# EAGLE design IoT Remote Control (EAGLE 9.6.2)
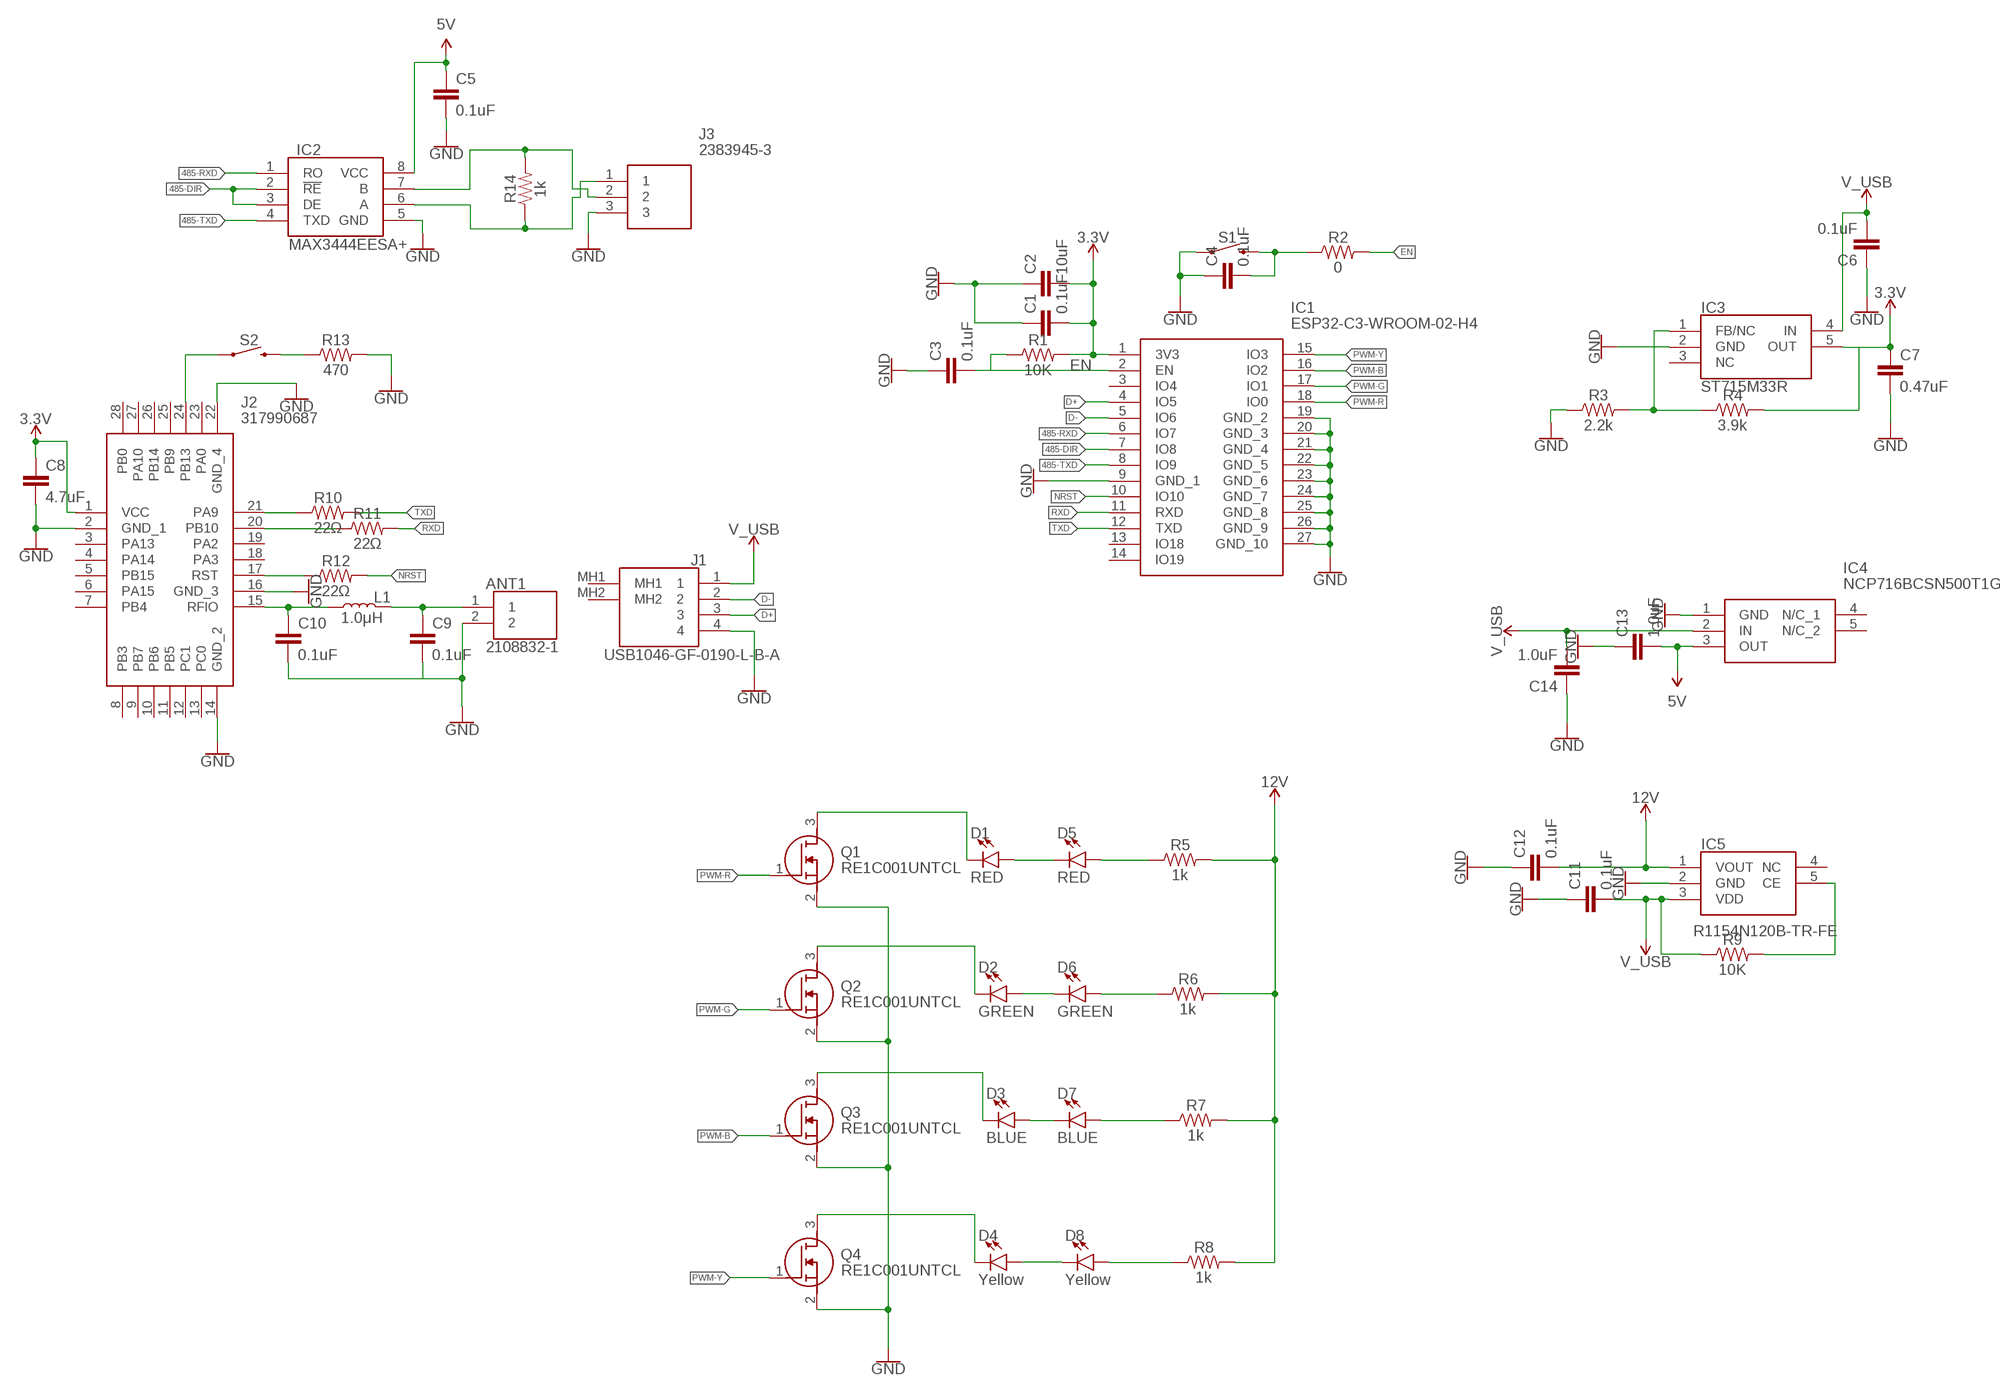
[diagram p0: schematic, sheet 1]

## Parts
ANT1  2108832-1  [21088321]
C1  0.1uF  0.1UF-0402T-6.3V-10%-X7R  [0402-TIGHT]
C2  10uF  10UF-0402T-6.3V-20%  [0402-TIGHT]
C3  0.1uF  0.1UF-0402T-6.3V-10%-X7R  [0402-TIGHT]
C4  0.1uF  0.1UF-0402T-6.3V-10%-X7R  [0402-TIGHT]
C5  0.1uF  0.1UF-0402T-6.3V-10%-X7R  [0402-TIGHT]
C6  0.1uF  0.1UF-0402T-6.3V-10%-X7R  [0402-TIGHT]
C7  0.47uF  470NF-0402_TIGHT-6.3V-10%-X5R  [0402-TIGHT]
C8  4.7uF  4.7UF-0402_TIGHT-6.3V-20%-X5R  [0402-TIGHT]
C9  0.1uF  0.1UF-0402T-6.3V-10%-X7R  [0402-TIGHT]
C10  0.1uF  0.1UF-0402T-6.3V-10%-X7R  [0402-TIGHT]
C11  0.1uF  0.1UF-0402T-6.3V-10%-X7R  [0402-TIGHT]
C12  0.1uF  0.1UF-0402T-6.3V-10%-X7R  [0402-TIGHT]
C13  1.0uF  1.0UF-0402T-16V-10%  [0402-TIGHT]
C14  1.0uF  1.0UF-0402T-16V-10%  [0402-TIGHT]
D1  RED  LED-RED0603  [LED-0603]
D2  GREEN  LED-GREEN0603  [LED-0603]
D3  BLUE  LED-BLUE0603  [LED-0603]
D4  Yellow  LED-YELLOW0603  [LED-0603]
D5  RED  LED-RED0603  [LED-0603]
D6  GREEN  LED-GREEN0603  [LED-0603]
D7  BLUE  LED-BLUE0603  [LED-0603]
D8  Yellow  LED-YELLOW0603  [LED-0603]
IC1  ESP32-C3-WROOM-02-H4  [ESP32C3WROOM02H4]
IC2  MAX3444EESA+  [SOIC127P600X175-8N]
IC3  ST715M33R  [SOT95P280X145-5N]
IC4  NCP716BCSN500T1G  [SOT95P275X110-5N]
IC5  R1154N120B-TR-FE  [SOT95P280X130-5N]
J1  USB1046-GF-0190-L-B-A  [USB1046GF0190LBA]
J2  317990687  [317990687]
J3  2383945-3  [23839453]
L1  1.0μH  1.0μH-0805_WIDE-1.0μH-1.4A-0.07OHM-1.4MM_H  [0805-WIDE]
Q1  RE1C001UNTCL  [SOTFL50P160X85-3N]
Q2  RE1C001UNTCL  [SOTFL50P160X85-3N]
Q3  RE1C001UNTCL  [SOTFL50P160X85-3N]
Q4  RE1C001UNTCL  [SOTFL50P160X85-3N]
R1  10K  10KOHM-0402-1/10W-0.1%  [0402-TIGHT]
R2  0  0OHM-0402T-1/10W  [0402-TIGHT]
R3  2.2k  2.2KOHM-0402T-1/16W-1%  [0402-TIGHT]
R4  3.9k  3.9KOHM-0603-1/10W-1%  [0603]
R5  1k  1KOHM-0402T-1/16W-1%  [0402-TIGHT]
R6  1k  1KOHM-0402T-1/16W-1%  [0402-TIGHT]
R7  1k  1KOHM-0402T-1/16W-1%  [0402-TIGHT]
R8  1k  1KOHM-0402T-1/16W-1%  [0402-TIGHT]
R9  10K  10KOHM-0402-1/10W-0.1%  [0402-TIGHT]
R10  22Ω  22OHM-0402T-1/16W-1%  [0402-TIGHT]
R11  22Ω  22OHM-0402T-1/16W-1%  [0402-TIGHT]
R12  22Ω  22OHM-0402T-1/16W-1%  [0402-TIGHT]
R13  470  470OHM-0402-TIGHT-1/16W-1%  [0402-TIGHT]
R14  1k  1KOHM-0402T-1/16W-1%  [0402-TIGHT]
S1  MOMENTARY-SWITCH-SPST-SMD-4.6X2.8MM  [TACTILE_SWITCH_SMD_4.6X2.8MM]
S2  MOMENTARY-SWITCH-SPST-SMD-4.6X2.8MM  [TACTILE_SWITCH_SMD_4.6X2.8MM]

## Nets
3.3V: C1.2 C2.2 C7.1 C8.1 IC1.1(3V3) IC3.5(OUT) J2.1(VCC) R1.2 R4.2
5V: C5.1 C13.2 IC2.8(VCC) IC4.3(OUT)
12V: C12.2 IC5.1(VOUT) R5.2 R6.2 R7.2 R8.2
485-DIR: IC1.7(IO8) IC2.2(!RE) IC2.3(DE)
485-RXD: IC1.6(IO7) IC2.1(RO)
485-TXD: IC1.8(IO9) IC2.4(TXD)
D+: IC1.4(IO5) J1.3
D-: IC1.5(IO6) J1.2
EN: C3.2 IC1.2(EN) R2.2
GND: ANT1.2 C1.1 C2.1 C3.1 C4.1 C5.2 C6.1 C7.2 C8.2 C10.2 C11.1 C12.1 C13.1 C14.1 IC1.9(GND_1) IC1.19(GND_2) IC1.20(GND_3) IC1.21(GND_4) IC1.22(GND_5) IC1.23(GND_6) IC1.24(GND_7) IC1.25(GND_8) IC1.26(GND_9) IC1.27(GND_10) IC2.5(GND) IC3.2(GND) IC4.1(GND) IC5.2(GND) J1.4 J2.2(GND_1) J2.14(GND_2) J2.16(GND_3) J2.22(GND_4) J3.3 Q1.2(S) Q2.2(S) Q3.2(S) Q4.2(S) R3.1 R13.2 S1.1 S1.2
N$1: C4.2 R2.1 S1.3 S1.4
N$2: IC3.1(FB/NC) R3.2 R4.1
N$3: R1.1
N$4: D3.A D7.C
N$5: D1.C Q1.3(D)
N$6: D2.C Q2.3(D)
N$7: D7.A R7.1
N$8: D8.A R8.1
N$9: D3.C Q3.3(D)
N$10: D4.C Q4.3(D)
N$11: D4.A D8.C
N$12: D6.A R6.1
N$13: IC5.5(CE) R9.2
N$14: D2.A D6.C
N$15: D1.A D5.C
N$16: D5.A R5.1
N$18: J2.21(PA9) R10.1
N$19: J2.20(PB10) R11.1
N$20: C10.1 J2.15(RFIO) L1.1
N$21: ANT1.1 C9.1 L1.2
N$22: C9.2
N$23: J2.17(RST) R12.1
N$24: J2.24(PB13) S2.1 S2.2
N$25: R13.1 S2.3 S2.4
N$26: IC2.7(B) J3.2 R14.2
N$27: IC2.6(A) J3.1 R14.1
NRST: IC1.10(IO10) R12.2
PWM-B: IC1.16(IO2) Q3.1(G)
PWM-G: IC1.17(IO1) Q2.1(G)
PWM-R: IC1.18(IO0) Q1.1(G)
PWM-Y: IC1.15(IO3) Q4.1(G)
RXD: IC1.11(RXD) R11.2
TXD: IC1.12(TXD) R10.2
V_USB: C6.2 C11.2 C14.2 IC3.4(IN) IC4.2(IN) IC5.3(VDD) J1.1 R9.1
Unconnected: IC1.3(IO4) IC1.13(IO18) IC1.14(IO19) IC3.3(NC) IC4.4(N/C_1) IC4.5(N/C_2) IC5.4(NC) J1.MH1 J1.MH2 J2.3(PA13) J2.4(PA14) J2.5(PB15) J2.6(PA15) J2.7(PB4) J2.8(PB3) J2.9(PB7) J2.10(PB6) J2.11(PB5) J2.12(PC1) J2.13(PC0) J2.18(PA3) J2.19(PA2) J2.23(PA0) J2.25(PB9) J2.26(PB14) J2.27(PA10) J2.28(PB0)

## Library data of the parts
ANT1 = 2108832-1:2108832-1: Antennas Chip ant., SMD, BT/Wi-Fi 2.4GHz Source: Datasheet <https://www.te.com/commerce/DocumentDelivery/DDEController?Action=showdoc&DocId=Customer Drawing2108832-CApdfEnglishENG_CD_2108832-C_A.pdf2108832-1>; DESCRIPTION: Antennas Chip ant., SMD, BT/Wi-Fi 2.4GHz; HEIGHT: 1.35mm; MANUFACTURER_NAME: TE Connectivity; MANUFACTURER_PART_NUMBER: 2108832-1
C1 C3-C6 C9-C12 = SparkFun-Capacitors:0.1UF: 0.1µF ceramic capacitors A capacitor is a passive two-terminal electrical component used to store electrical energy temporarily in an electric field.; PROD_ID: CAP-14993
C2 = SparkFun-Capacitors:10UF: 10.0µF ceramic capacitors A capacitor is a passive two-terminal electrical component used to store electrical energy temporarily in an electric field.; PROD_ID: CAP-14848
C7 = SparkFun-Capacitors:470NF: 0.47uF/470nF ceramic capacitors A capacitor is a passive two-terminal electrical component used to store electrical energy temporarily in an electric field.; PROD_ID: CAP-14242
C8 = SparkFun-Capacitors:4.7UF: 4.7µF ceramic capacitors A capacitor is a passive two-terminal electrical component used to store electrical energy temporarily in an electric field.; PROD_ID: CAP-14240
C13 C14 = SparkFun-Capacitors:1.0UF: 1µF ceramic capacitors A capacitor is a passive two-terminal electrical component used to store electrical energy temporarily in an electric field.; PROD_ID: CAP-12417
D1 D5 = SparkFun-LED:LED-RED: Red SMD LED Used in manufacturing of most products at SparkFun Packages: 0603 - SMD 0603 package [Product Link] <http://docs.avagotech.com/docs/AV02-0551EN> 0603 SMART - SMD 0603 SMART package ( more efficient and expensive)[Product Link] <http://www.osram-os.com/Graphics/XPic2/00077099_0.pdf> 1206 - SMD1206 package [Product Link] <https://www.sparkfun.com/datasheets/DevTools/LilyPad/Q150OVS4.pdff> SparkFun Products: Pro Mini 328 -5V <https://www.sparkfun.com/products/821> RedBoard <https://www.sparkfun.com/products/12757> IOIO-OTG <https://www.sparkfun.com/products/13613>; PROD_ID: DIO-00819
D2 D6 = SparkFun-LED:LED-GREEN: Green SMD LED Used in manufacturing of various products at SparkFun Packages: 0603 - SMD 0603 package [Product Link] <http://www.futureelectronics.com/en/technologies/semiconductors/optoelectronics/leds/Pages/9894312-LTST-C190GKT.aspx?CrossPart=HSMG-C190&IM=0> LilyPad 1206 - SMD1206 LilyPad package [Product Link] <http://www.futureelectronics.com/en/Technologies/Product.aspx?ProductID=IN150NGHARVATEKCORPORATION2049943&IM=0> 1206 - SMD1206 package [Product Link] <http://www.futureelectronics.com/en/technologies/semiconductors/optoelectronics/leds/Pages/8315665-LTST-C150KGKT.aspx?IM=0> 1206 Bottom Mount -SMD 1206 Bottom Mount [Product Link] <http://www.digikey.com/product-detail/en/lite-on-inc/LTST-C230KGKT/160-1456-1-ND/386854> SparkFun Products: Pro Mini 328 -5V <https://www.sparkfun.com/products/821> RedBoard <https://www.sparkfun.com/products/12757> MP3 Trigger <https://www.sparkfun.com/products/13720> Makey Makey <https://www.sparkfun.com/products/11076>; PROD_ID: DIO-00821
D3 D7 = SparkFun-LED:LED-BLUE: Blue SMD LED Used in manufacturing of various products at SparkFun Packages: 0603 - SMD 0603 package [Product Link] <http://www.digikey.com/product-detail/en/SMLE12BC7TT86/511-1589-2-ND/1641808> 1206 - SMD1206 package [Product Link] <http://www.digikey.com/product-detail/en/lite-on-inc/LTST-C150TBKT/160-1643-1-ND/573584> SparkFun Products: ESP8266 Thing-Dev Board <https://www.sparkfun.com/products/13711> RedBoard <https://www.sparkfun.com/products/12757>; PROD_ID: DIO-08575
D4 D8 = SparkFun-LED:LED-YELLOW: Yellow SMD LED Used in manufacturing several products at SparkFun. Packages: 0603 - SMD 0603 package[Product Link] <http://www.kingbrightusa.com/product.asp?catalog_name=LED&product_id=APT1608SYCK> 0603 -SMART - SMART SMD 0603 package (more efficient/more expensive) [Product Link] <http://www.osram-os.com/osram_os/en/products/product-catalog/led-light-emitting-diodes/smartled-0603/ly-l29k/index.jsp> LilyPad - SMD1206 package[Product Datasheet] <https://www.sparkfun.com/datasheets/DevTools/LilyPad/Q150YUS4.pdf> SparkFun Products: Blynk Board <https://www.sparkfun.com/products/13794> IOIO-OTG <https://www.sparkfun.com/products/13613> XBee Explorer Serial <https://www.sparkfun.com/products/13225>; PROD_ID: DIO-09003
IC1 = ESP32-C3-WROOM-02-H4:ESP32-C3-WROOM-02-H4: WiFi Modules (802.11) SMD module, ESP32-C3, 4MB SPI flash, PCB antenna, -40 C +105 C Source: Datasheet <https://www.mouser.in/datasheet/2/891/Espressif_Systems_04082021_ESP32_C3_WROOM_02-2295851.pdf>; DESCRIPTION: WiFi Modules (802.11) SMD module, ESP32-C3, 4MB SPI flash, PCB antenna, -40 C +105 C; HEIGHT: 3.35mm; MANUFACTURER_NAME: Espressif Systems; MANUFACTURER_PART_NUMBER: ESP32-C3-WROOM-02-H4; MOUSER_PART_NUMBER: 356-ESP32C3WROOM02H4; MOUSER_PRICE-STOCK: https://www.mouser.co.uk/ProductDetail/Espressif-Systems/ESP32-C3-WROOM-02-H4?qs=stqOd1AaK79%2FSA14oWtR%252Bw%3D%3D
IC2 = MAX3444EESA+:MAX3444EESA+: Maxim MAX3444EESA+, Line Transceiver, RS-485, 4.75 5.25 V, 8-Pin SOIC Source: Datasheet <https://pdfserv.maximintegrated.com/en/ds/MAX3440E-MAX3444E.pdf>; DESCRIPTION: Maxim MAX3444EESA+, Line Transceiver, RS-485, 4.75 5.25 V, 8-Pin SOIC; HEIGHT: 1.75mm; MANUFACTURER_NAME: Maxim Integrated; MANUFACTURER_PART_NUMBER: MAX3444EESA+; MOUSER_PART_NUMBER: 700-MAX3444EESA; MOUSER_PRICE-STOCK: https://www.mouser.co.uk/ProductDetail/Maxim-Integrated/MAX3444EESA%2b/?qs=1THa7WoU59Hlh25KMQ%252Bj%252BQ%3D%3D
IC3 = ST715M33R:ST715M33R: LDO Voltage Regulators HI INPUT VOLTAGE 85mA LDO LINEAR REG Source: Datasheet <https://datasheet.datasheetarchive.com/originals/distributors/Datasheets-DGA25/1774080.pdf>; ARROW_PART_NUMBER: ST715M33R; ARROW_PRICE-STOCK: https://www.arrow.com/en/products/st715m33r/stmicroelectronics?region=nac; DESCRIPTION: LDO Voltage Regulators HI INPUT VOLTAGE 85mA LDO LINEAR REG; HEIGHT: 1.45mm; MANUFACTURER_NAME: STMicroelectronics; MANUFACTURER_PART_NUMBER: ST715M33R; MOUSER_PART_NUMBER: 511-ST715M33R; MOUSER_PRICE-STOCK: https://www.mouser.co.uk/ProductDetail/STMicroelectronics/ST715M33R?qs=SU4Xa%252BYHGQp%252B3Qoof482xw%3D%3D
IC4 = NCP716BCSN500T1G:NCP716BCSN500T1G: LDO Voltage Regulators WIDE VIN LDO LINEAR VOLTAGE REGULATOR 5V VERSION Source: Datasheet <https://www.mouser.jp/datasheet/2/308/NCP716BC_D-2255835.pdf>; DESCRIPTION: LDO Voltage Regulators WIDE VIN LDO LINEAR VOLTAGE REGULATOR 5V VERSION; HEIGHT: 1.1mm; MANUFACTURER_NAME: onsemi; MANUFACTURER_PART_NUMBER: NCP716BCSN500T1G; MOUSER_PART_NUMBER: 863-NCP716BCSN500T1G; MOUSER_PRICE-STOCK: https://www.mouser.co.uk/ProductDetail/onsemi/NCP716BCSN500T1G?qs=stqOd1AaK79aqdrzlQcxdg%3D%3D
IC5 = R1154N120B-TR-FE:R1154N120B-TR-FE: 150 mA Voltage Regulator (Wide Input Voltage Range) Source: Datasheet <https://www.nisshinbo-microdevices.co.jp/en/pdf/datasheet/r1154-ea.pdf>; DESCRIPTION: 150 mA Voltage Regulator (Wide Input Voltage Range); HEIGHT: 1.3mm; MANUFACTURER_NAME: Nisshinbo; MANUFACTURER_PART_NUMBER: R1154N120B-TR-FE
J1 = USB1046-GF-0190-L-B-A:USB1046-GF-0190-L-B-A: USB Connectors USB A Skt, Top Mount, SMT, R/A, GF, Black, With 1.9mm shell stake, T&R Source: Datasheet <https://gct.co/files/drawings/usb1046.pdf?v=ccb5d20d-0631-4297-aa3c-9c34fccf9fbc>; DESCRIPTION: USB Connectors USB A Skt, Top Mount, SMT, R/A, GF, Black, With 1.9mm shell stake, T&R; HEIGHT: 7.2mm; MANUFACTURER_NAME: GCT (GLOBAL CONNECTOR TECHNOLOGY); MANUFACTURER_PART_NUMBER: USB1046-GF-0190-L-B-A; MOUSER_PART_NUMBER: 640-USB1046GF0190LBA; MOUSER_PRICE-STOCK: https://www.mouser.co.uk/ProductDetail/GCT/USB1046-GF-0190-L-B-A?qs=KUoIvG%2F9IlbZOJtEsn1unA%3D%3D
J2 = 317990687:317990687: Sub-GHz Modules LoRa-E5 Wireless Module Source: Datasheet <https://files.seeedstudio.com/products/317990687/res/LoRa-E5 module datasheet_V1.0.pdf>; DESCRIPTION: Sub-GHz Modules LoRa-E5 Wireless Module; HEIGHT: 2.5mm; MANUFACTURER_NAME: Seeed Studio; MANUFACTURER_PART_NUMBER: 317990687; MOUSER_PART_NUMBER: 713-317990687; MOUSER_PRICE-STOCK: https://www.mouser.co.uk/ProductDetail/Seeed-Studio/317990687?qs=hd1VzrDQEGhZOj13wvzSLA%3D%3D
J3 = 2383945-3:2383945-3: Pluggable Terminal Blocks TERMI-BLOK SMD MOUNT 180_3P_3.81 MM 12A Source: Datasheet <https://www.te.com/commerce/DocumentDelivery/DDEController?Action=showdoc&DocId=Customer Drawing2383945A1pdfEnglishENG_CD_2383945_A1.pdf2383945-3>; ARROW_PART_NUMBER: 2383945-3; ARROW_PRICE-STOCK: https://www.arrow.com/en/products/2383945-3/te-connectivity?region=nac; DESCRIPTION: Pluggable Terminal Blocks TERMI-BLOK SMD MOUNT 180_3P_3.81 MM 12A; HEIGHT: 8.65mm; MANUFACTURER_NAME: TE Connectivity; MANUFACTURER_PART_NUMBER: 2383945-3; MOUSER_PART_NUMBER: 571-2383945-3; MOUSER_PRICE-STOCK: https://www.mouser.co.uk/ProductDetail/TE-Connectivity/2383945-3?qs=QNEnbhJQKvbj0hB3OfzLmA%3D%3D
L1 = SparkFun-Coils:1.0μH: 1.0μH Inductor Resist changes in electrical current. Basically a coil of wire. SparkFun Products: SparkFun Edge <https://www.sparkfun.com/products/15170>; PROD_ID: NDUC-14237
Q1-Q4 = RE1C001UNTCL:RE1C001UNTCL: MOSFET,N-channel,20V,100mA,SOT416FL Source: Datasheet <https://datasheet.datasheetarchive.com/originals/distributors/Datasheets_SAMA/a252995f86c5e28cb0f632a782a2eea5.pdf>; DESCRIPTION: MOSFET,N-channel,20V,100mA,SOT416FL; HEIGHT: 0.85mm; MANUFACTURER_NAME: ROHM Semiconductor; MANUFACTURER_PART_NUMBER: RE1C001UNTCL; MOUSER_PART_NUMBER: 755-RE1C001UNTCL; MOUSER_PRICE-STOCK: https://www.mouser.co.uk/ProductDetail/ROHM-Semiconductor/RE1C001UNTCL?qs=QcFhgjUTvvoqHeGWcl8O5g%3D%3D
R1 R9 = SparkFun-Resistors:10KOHM: 10kΩ resistor A resistor is a passive two-terminal electrical component that implements electrical resistance as a circuit element. Resistors act to reduce current flow, and, at the same time, act to lower voltage levels within circuits. - Wikipedia; PROD_ID: RES-16147
R2 = SparkFun-Resistors:0OHM: 0Ω resistor A resistor is a passive two-terminal electrical component that implements electrical resistance as a circuit element. Resistors act to reduce current flow, and, at the same time, act to lower voltage levels within circuits. - Wikipedia; PROD_ID: RES-14244
R3 = SparkFun-Resistors:2.2KOHM: 2.2kΩ resistor A resistor is a passive two-terminal electrical component that implements electrical resistance as a circuit element. Resistors act to reduce current flow, and, at the same time, act to lower voltage levels within circuits. - Wikipedia; PROD_ID: RES-14341
R4 = SparkFun-Resistors:3.9KOHM: 3.9kΩ resistor A resistor is a passive two-terminal electrical component that implements electrical resistance as a circuit element. Resistors act to reduce current flow, and, at the same time, act to lower voltage levels within circuits. - Wikipedia; PROD_ID: RES-08701
R5-R8 R14 = SparkFun-Resistors:1KOHM: 1kΩ resistor A resistor is a passive two-terminal electrical component that implements electrical resistance as a circuit element. Resistors act to reduce current flow, and, at the same time, act to lower voltage levels within circuits. - Wikipedia; PROD_ID: RES-14342
R10-R12 = SparkFun-Resistors:22OHM: 22Ω resistor A resistor is a passive two-terminal electrical component that implements electrical resistance as a circuit element. Resistors act to reduce current flow, and, at the same time, act to lower voltage levels within circuits. - Wikipedia; PROD_ID: RES-12427
R13 = SparkFun-Resistors:470OHM: 470Ω resistor A resistor is a passive two-terminal electrical component that implements electrical resistance as a circuit element. Resistors act to reduce current flow, and, at the same time, act to lower voltage levels within circuits. - Wikipedia; PROD_ID: RES-15584
S1 S2 = SparkFun-Switches:MOMENTARY-SWITCH-SPST: Momentary Switch (Pushbutton) - SPST Normally-open (NO) SPST momentary switches (buttons, pushbuttons). Variants PTH-12MM - 12mm square, through-hole Momentary Pushbutton Switch - 12mm Square <https://www.sparkfun.com/products/9190> (COM-09190) PTH-6.0MM, PTH-6.0MM-KIT - 6.0mm square, through-hole Mini Pushbutton Switch <https://www.sparkfun.com/products/97> (COM-00097) KIT package intended for soldering kit's - only one side of pads' copper is exposed. PTH-RIGHT-ANGLE-KIT - Right-angle, through-hole Right Angle Tactile Button <https://www.sparkfun.com/products/10791> - Used on SparkFun BigTime Watch Kit <https://www.sparkfun.com/products/11734> SMD-12MM - 12mm square, surface-mount Tactile Button - SMD (12mm) <https://www.sparkfun.com/products/12993> (COM-12993) Used on SparkFun PicoBoard <https://www.sparkfun.com/products/11888> SMD-4.5MM - 4.5mm Square Trackball Switch Used on SparkFun Blackberry Trackballer Breakout <https://www.sparkfun.com/products/13169> SMD-4.6MMX2.8MM - 4.60mm x 2.80mm, surface mount Used on SparkFun Pro Micro - RP2040 <https://www.sparkfun.com/products/17717> SMD-5.2MM, SMD-5.2-REDUNDANT - 5.2mm square, surface-mount Mini Pushbutton Switch - SMD <https://www.sparkfun.com/products/8720> (COM-08720) Used on Arduino Pro Mini <https://www.sparkfun.com/products/11114> REDUNDANT package connects both switch circuits together SMD-6.0X3.5MM - 6.0 x 3.5mm, surface mount Momentary Reset Switch SMD <https://www.sparkfun.com/products/8229> (COM-08229) SMD-6.2MM-TALL - 6.2mm square, surface mount Tactile Button - SMD (6mm) <https://www.sparkfun.com/products/12992> Used on SparkFun Digital Sandbox <https://www.sparkfun.com/products/12651> SMD-RIGHT-ANGLE - Right-angle, surface mount Used on SparkFun Block for Intel® Edison - Arduino <https://www.sparkfun.com/products/13036>; PROD_ID: SWCH-15606

## Board
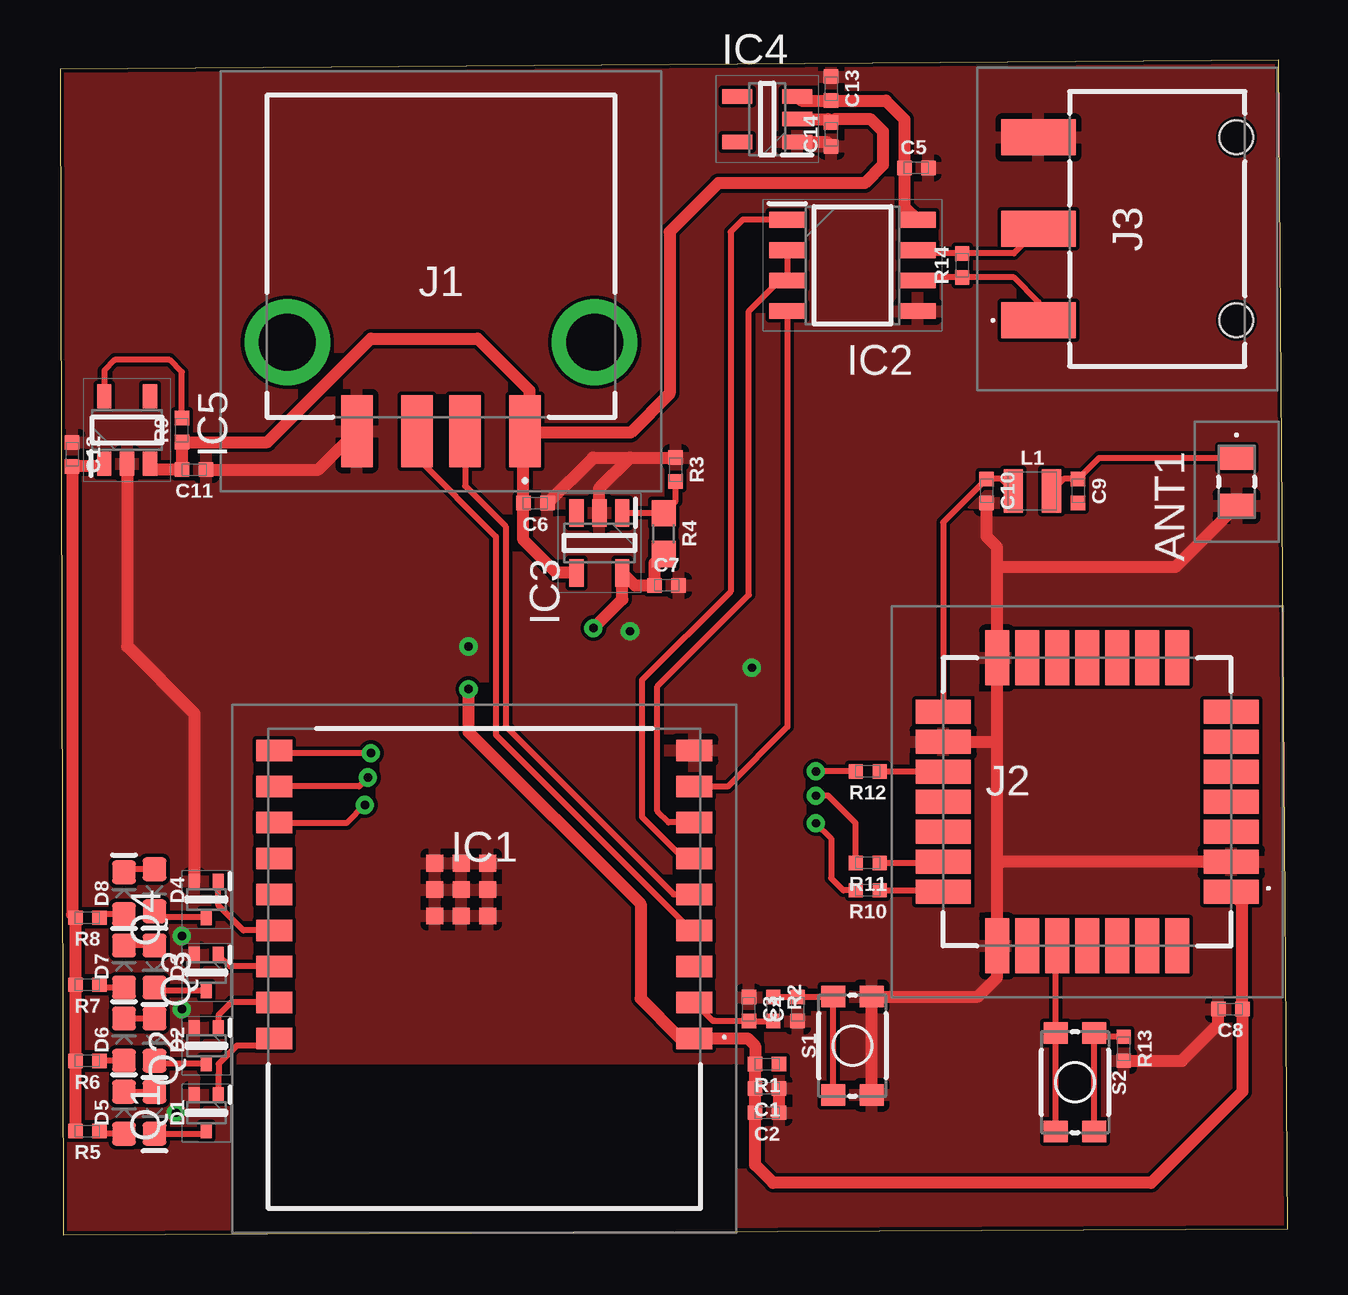
[diagram p1: board, top side]
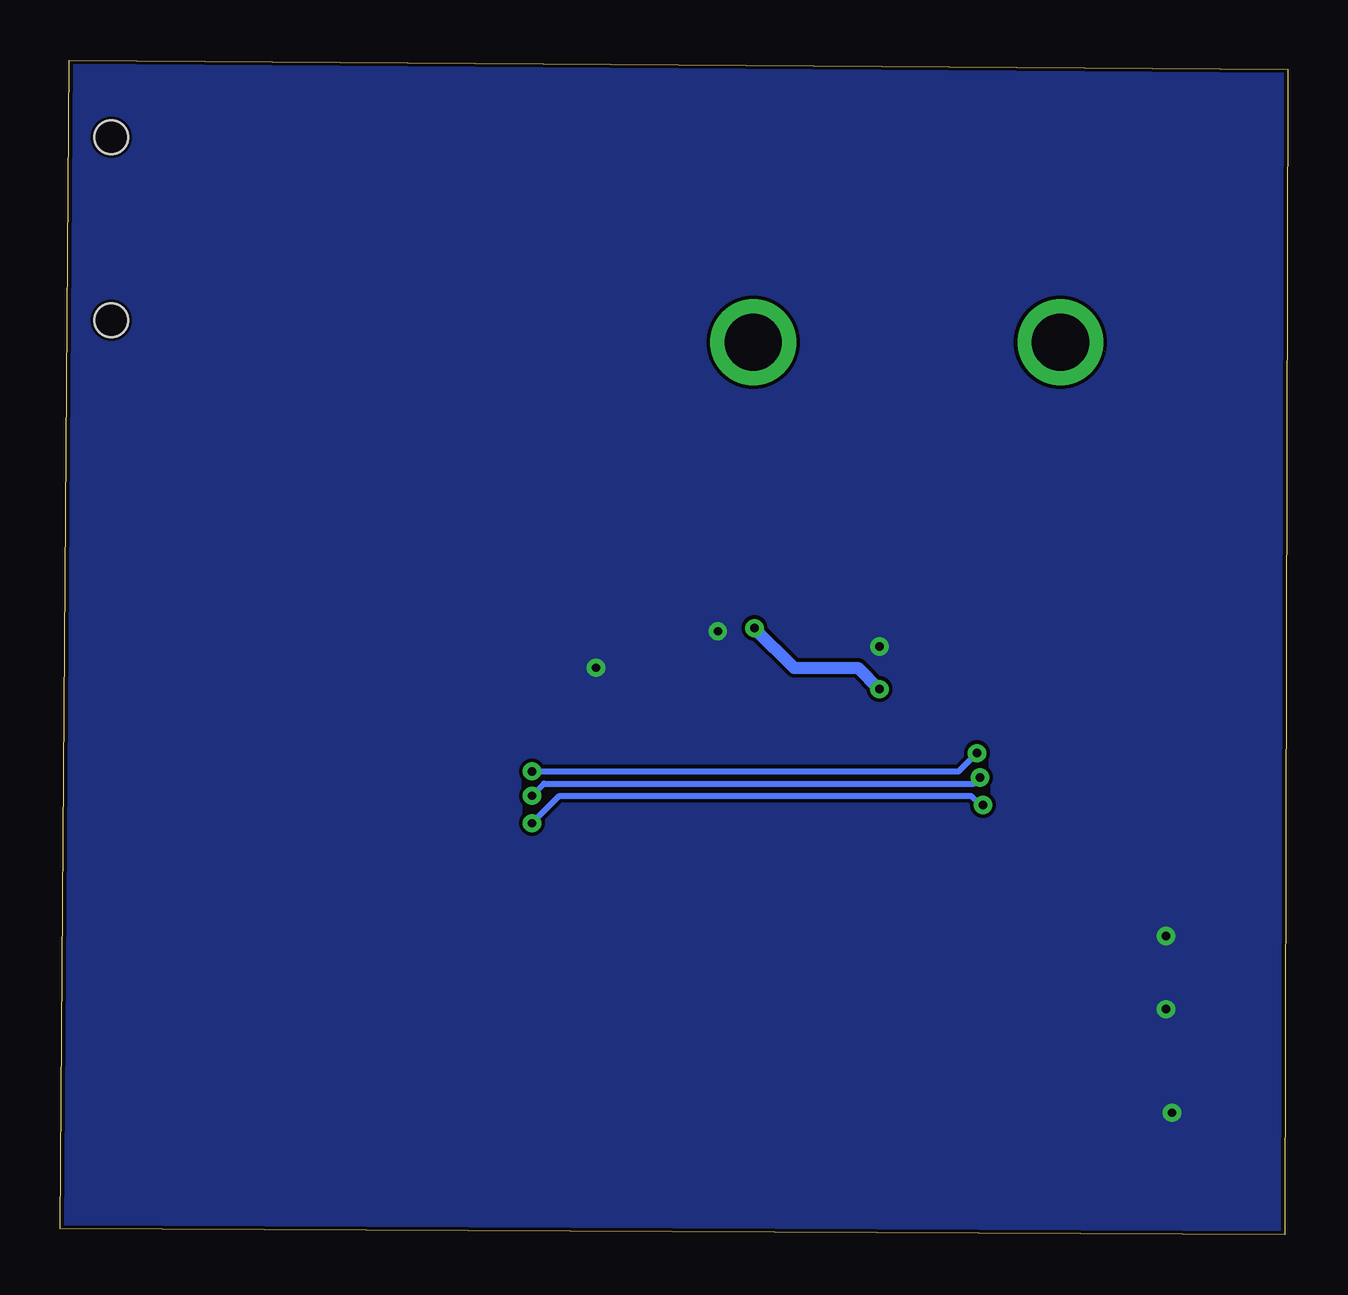
[diagram p2: board, bottom side, seen from below]

Size 51.16 x 48.95 mm. Coordinates in mm from the lower left corner, seen from the top.
Outline: 0.13,0 51.16,0.25 50.78,48.95 0,48.56 0.13,0
Copper layers (1*16): Top 0.035mm / dielectric 1.5mm / Bottom 0.035mm
Design rules "default *": minimum track width 6mil, minimum drill 0.35mm, track to track 6mil, track to pad 6mil, pad to pad 6mil, via to via 6mil, smd to smd 6mil, copper to edge 6mil, drill to drill 6mil, minimum pad ring 10mil, minimum via ring 8mil, stop-mask expansion 4mil, vias tented up to drill 0mil, thermal gap 10mil

### Footprints (pad centres in the part's own frame; a part is rotated, then mirrored left to right if it is on the bottom)
21088321 = smd 1 x 1.5: 1 -1,0; 2 1,0
0402-TIGHT = smd 0.6 x 0.6: 1 -0.5,0; 2 0.5,0
LED-0603 = smd 1 x 1: A -0.877,0; C 0.877,0
ESP32C3WROOM02H4 = smd 1.5 x 0.9: 1 0.75,12.9; 2 0.75,11.4; 3 0.75,9.9; 4 0.75,8.4; 5 0.75,6.9; 6 0.75,5.4; 7 0.75,3.9; 8 0.75,2.4; 9 0.75,0.9; 10 18.25,0.9; 11 18.25,2.4; 12 18.25,3.9; 13 18.25,5.4; 14 18.25,6.9; 15 18.25,8.4; 16 18.25,9.9; 17 18.25,11.4; 18 18.25,12.9 | smd 0.7 x 0.7: 19 10.46,6.7; 20 11.56,6.7; 21 11.56,7.8; 22 10.46,7.8; 23 9.36,7.8; 24 9.36,6.7; 25 9.36,5.6; 26 10.46,5.6; 27 11.56,5.6
SOIC127P600X175-8N = smd 1.525 x 0.65: 1 -2.712,1.905; 2 -2.712,0.635; 3 -2.712,-0.635; 4 -2.712,-1.905; 5 2.712,-1.905; 6 2.712,-0.635; 7 2.712,0.635; 8 2.712,1.905
SOT95P280X145-5N = smd 1.15 x 0.6: 1 -1.25,0.95; 2 -1.25,0; 3 -1.25,-0.95; 4 1.25,-0.95; 5 1.25,0.95
SOT95P275X110-5N = smd 1.25 x 0.6: 1 -1.25,0.95; 2 -1.25,0; 3 -1.25,-0.95; 4 1.25,-0.95; 5 1.25,0.95
SOT95P280X130-5N = smd 1 x 0.6: 1 -1.4,0.95; 2 -1.4,0; 3 -1.4,-0.95; 4 1.4,-0.95; 5 1.4,0.95
USB1046GF0190LBA = smd 1.3 x 3: 1 -3.5,7.28; 2 -1,7.28; 3 1,7.28; 4 3.5,7.28 | drill 2.38 pad 3.57: MH1 -6.4,3.58; MH2 6.4,3.58
317990687 = smd 2.3 x 1: 1 -6,3.75; 2 -6,2.5; 3 -6,1.25; 4 -6,0; 5 -6,-1.25; 6 -6,-2.5; 7 -6,-3.75; 15 6,-3.75; 16 6,-2.5; 17 6,-1.25; 18 6,0; 19 6,1.25; 20 6,2.5; 21 6,3.75 | smd 1 x 2.3: 8 -3.75,-6; 9 -2.5,-6; 10 -1.25,-6; 11 0,-6; 12 1.25,-6; 13 2.5,-6; 14 3.75,-6; 22 3.75,6; 23 2.5,6; 24 1.25,6; 25 0,6; 26 -1.25,6; 27 -2.5,6; 28 -3.75,6
23839453 = smd 1.5 x 3.1: 1 -3.81,4.95; 2 0,4.95; 3 3.81,4.95 | hole 1.4: -3.81,-3.3; 3.81,-3.3
0805-WIDE = smd 0.8 x 1.8: 1 -0.8,0; 2 0.8,0
SOTFL50P160X85-3N = smd 0.64 x 0.47: 1 -0.75,0.5; 2 -0.75,-0.5; 3 0.75,0
0603 = smd 1.1 x 1: 1 -0.85,0; 2 0.85,0
TACTILE_SWITCH_SMD_4.6X2.8MM = smd 0.9 x 1: 1 -2.05,-0.8; 2 2.05,-0.8; 3 2.05,0.8; 4 -2.05,0.8

### Placement (x,y rotation side)
ANT1  49.02,31.37 270 top
C1  29.46,6.1 180 top
C2  29.46,5.08 180 top
C3  28.7,9.4 270 top
C4  30.73,9.4 90 top
C5  35.69,44.45 0 top
C6  19.81,30.48 180 top
C7  25.27,27.05 0 top
C8  48.77,9.4 180 top
C9  42.42,30.99 270 top
C10  38.61,30.99 270 top
C11  5.59,31.88 180 top
C12  0.51,32.51 270 top
C13  32.13,47.75 270 top
C14  32.13,45.85 90 top
D1  3.94,5.08 270 top
D2  3.94,8.13 270 top
D3  3.94,11.18 270 top
D4  3.94,14.35 270 top
D5  2.67,5.08 90 top
D6  2.67,8.13 90 top
D7  2.67,11.18 90 top
D8  2.67,14.22 90 top
IC1  27.18,21.08 180 top
IC2  33.02,40.39 0 top
IC3  22.48,28.83 270 top
IC4  29.46,46.48 180 top
IC5  2.79,33.53 90 top
J1  15.87,40.77 180 top
J2  42.8,18.03 180 top
J3  45.72,41.91 90 top
L1  40.51,30.99 0 top
Q1  6.1,5.08 270 top
Q2  6.1,7.87 270 top
Q3  6.1,10.92 270 top
Q4  6.1,13.97 270 top
R1  29.46,7.11 180 top
R2  29.72,9.4 270 top
R3  25.65,31.88 270 top
R4  25.15,29.21 270 top
R5  1.14,4.32 180 top
R6  1.14,7.24 180 top
R7  1.14,10.41 180 top
R8  1.14,13.21 180 top
R9  5.08,33.53 90 top
R10  33.66,14.35 180 top
R11  33.66,15.49 180 top
R12  33.66,19.3 180 top
R13  44.32,7.75 270 top
R14  37.59,40.39 90 top
S1  33.02,7.87 90 top
S2  42.29,6.35 270 top

### Tracks (layer width: path | path; a pad name or v marks a point on that pad's centre or on a via)
3.3V  (via drill 0.35)
  Top 0.508: R4.2 24.77,27.99 C7.1 23.96,27.05 IC3.5 23.43,26.48 v22.23,25.27 | J2.1 49.27,13.82 C8.1 49.27,5.96 45.47,2.16 29.72,2.16 28.96,2.91 C2.2 C1.2 R1.2 28.96,7.87 28.65,8.18 IC1.1 25.85,8.18 24.19,9.84 24.19,13.78 17.02,20.96 v17.02,22.73
  Bottom 0.508: v22.23,25.27 20.57,23.62 17.91,23.62 v17.02,22.73
5V
  Top 0.508: IC4.3 30.89,47.25 C13.2 34.41,47.25 35.19,46.47 C5.1 35.19,42.84 IC2.8
12V
  Top 0.508: R5.2 R6.2 R7.2 R8.2 0.51,13.34 C12.2 1.73,32.01 IC5.1
485-DIR
  Top 0.254: IC1.7 25.36,17.18 24.89,17.65 24.89,22.85 28.7,26.66 28.7,38.48 30.1,39.88 30.31,39.88 | IC2.2 30.31,39.88 | 30.31,39.88 IC2.3
485-RXD
  Top 0.254: IC1.6 25.97,15.68 24.26,17.4 24.26,23.11 27.94,26.8 27.94,41.78 28.45,42.29 IC2.1
485-TXD
  Top 0.254: IC2.4 30.31,21.16 27.81,18.67 26.44,18.67 IC1.8
D+
  Top 0.254: IC1.4 26.31,12.68 18.16,20.83 18.16,29.08 14.87,32.37 J1.3
D-
  Top 0.254: IC1.5 25.57,14.18 18.57,21.18 18.57,29.51 16.88,31.2 J1.2
EN
  Top 0.254: IC1.2 27.2,8.91 27.29,8.91 27.31,8.9 C3.2 R2.2
GND  (via drill 0.35)
  Top 0.508: 33.78,5.79 S1.1 S1.2 38.24,9.92 39.05,10.73 J2.22 39.05,15.37 | C2.1 C1.1 | C11.1 10.76,31.88 J1.4 | R13.2 46.74,7.25 48.27,8.77 C8.2 | 36.84,20.57 J2.16 38.96,20.53 39.05,20.45 | 39.05,15.37 39.05,20.45 | 39.05,20.45 J2.14 39.05,27.81 | 39.05,27.81 39.05,28.64 38.61,29.08 C10.2 | ANT1.2 46.47,27.81 39.05,27.81 | IC5.2 2.79,24.51 5.6,21.71 Q4.2 | IC3.2 22.48,31.12 23.74,32.38 | 23.74,32.38 R3.1 | C6.1 22.21,32.38 23.74,32.38 | J2.2 39.22,15.53 39.05,15.37 | IC4.1 31.95,45.53 C14.1
  other vias: 17.02,24.51 28.83,23.62 23.75,25.15 5.08,9.4 5.08,12.45 4.83,5.08
  pour Top: -0.25,50.93 50.8,50.93 53.72,48.01 53.72,0.38 50.16,-3.17 0.13,-3.17 -3.56,0.51 -3.56,47.62
  pour Bottom: 0.13,53.09 50.67,53.09 56.13,47.62 56.13,0.51 49.91,-5.71 0.76,-5.71 -5.46,0.51 -5.46,47.5
N$1
  Top 0.254: S1.4 S1.3 32.19,9.9 C4.2 R2.1
N$2
  Top 0.254: R3.2 25.65,30.57 R4.1 25.13,30.08 IC3.1
N$4
  Top 0.254: D3.A D7.C
N$5
  Top 0.254: D1.C 5.97,4.2 Q1.3
N$6
  Top 0.254: Q2.3 4.06,7.12 D2.C
N$7
  Top 0.254: D7.A 1.76,10.3 R7.1
N$8
  Top 0.254: D8.A 1.78,13.35 R8.1
N$9
  Top 0.254: Q3.3 4.06,10.17 D3.C
N$10
  Top 0.254: Q4.3 4.19,13.22 D4.C
N$11
  Top 0.254: D8.C 2.79,15.23 D4.A
N$12
  Top 0.254: D6.A R6.1
N$13
  Top 0.254: R9.2 5.08,35.94 4.57,36.45 2.29,36.45 1.84,36.01 IC5.5
N$14
  Top 0.254: D2.A D6.C
N$15
  Top 0.254: D5.C D1.A
N$16
  Top 0.254: D5.A 1.76,4.2 R5.1
N$17
  cutout Top: 7.24,6.99 28.07,6.99 28.07,0.13 7.37,0.13 7.24,0.25
N$18
  Top 0.254: R10.1 36.73,14.35 J2.21
N$19
  Top 0.254: R11.1 36.76,15.49 J2.20
N$20
  Top 0.254: L1.1 39.21,31.49 C10.1 36.8,29.68 J2.15
N$21
  Top 0.254: L1.2 41.81,31.49 C9.1 43.3,32.37 ANT1.1
N$23
  Top 0.254: R12.1 36.78,19.3 J2.17
N$24
  Top 0.254: J2.24 41.49,11.98 S2.1 S2.2
N$25
  Top 0.254: R13.1 43.24,8.25 | 43.24,8.25 S2.4 | S2.3 43.09,8.09 43.24,8.25
N$26
  Top 0.254: J3.2 39.75,40.89 R14.2 35.87,40.89 IC2.7
N$27
  Top 0.254: IC2.6 35.87,39.89 R14.1 39.74,39.89 40.77,38.86 J3.1
NRST  (via drill 0.35)
  Top 0.254: R12.2 v31.5,19.3 | v12.95,20.07 9.04,20.07 IC1.10
  Bottom 0.254: v31.5,19.3 13.72,19.3 v12.95,20.07
PWM-B
  Top 0.254: IC1.16 7.09,11.18 Q3.1
PWM-G
  Top 0.254: IC1.17 7.14,9.68 6.6,9.14 Q2.1
PWM-R
  Top 0.254: IC1.18 8.62,7.87 7.37,7.87 6.61,7.12 6.61,6.69 6.6,6.67 Q1.1
PWM-Y
  Top 0.254: IC1.15 7.64,12.68 6.6,13.72 Q4.1
RXD  (via drill 0.35)
  Top 0.254: R11.2 33.16,17.14 32,18.3 v31.5,18.3 v31.5,18.29 | v12.83,19.05 12.46,18.68 IC1.11
  Bottom 0.254: v31.5,18.29 30.99,18.8 13.08,18.8 v12.83,19.05
TXD  (via drill 0.35)
  Top 0.254: R10.2 32.64,14.35 32.13,14.86 32.13,16.51 v31.5,17.14 | v12.7,17.91 11.94,17.14 8.97,17.14 IC1.12
  Bottom 0.254: v31.5,17.14 30.35,18.29 13.21,18.29 12.83,17.91 v12.7,17.91
V_USB
  Top 0.508: IC5.3 3.99,31.88 C11.2 5.08,31.89 R9.1 8.64,33.03 12.95,37.34 17.4,37.34 19.56,35.18 19.56,33.3 J1.1 19.31,33.42 | IC3.4 20.68,27.58 19.31,28.95 C6.2 19.31,33.42 | IC4.2 32,46.48 C14.2 32.26,46.47 33.79,46.47 34.29,45.97 34.29,44.58 33.53,43.81 27.43,43.81 25.4,41.78 25.4,35.05 23.77,33.42 19.31,33.42